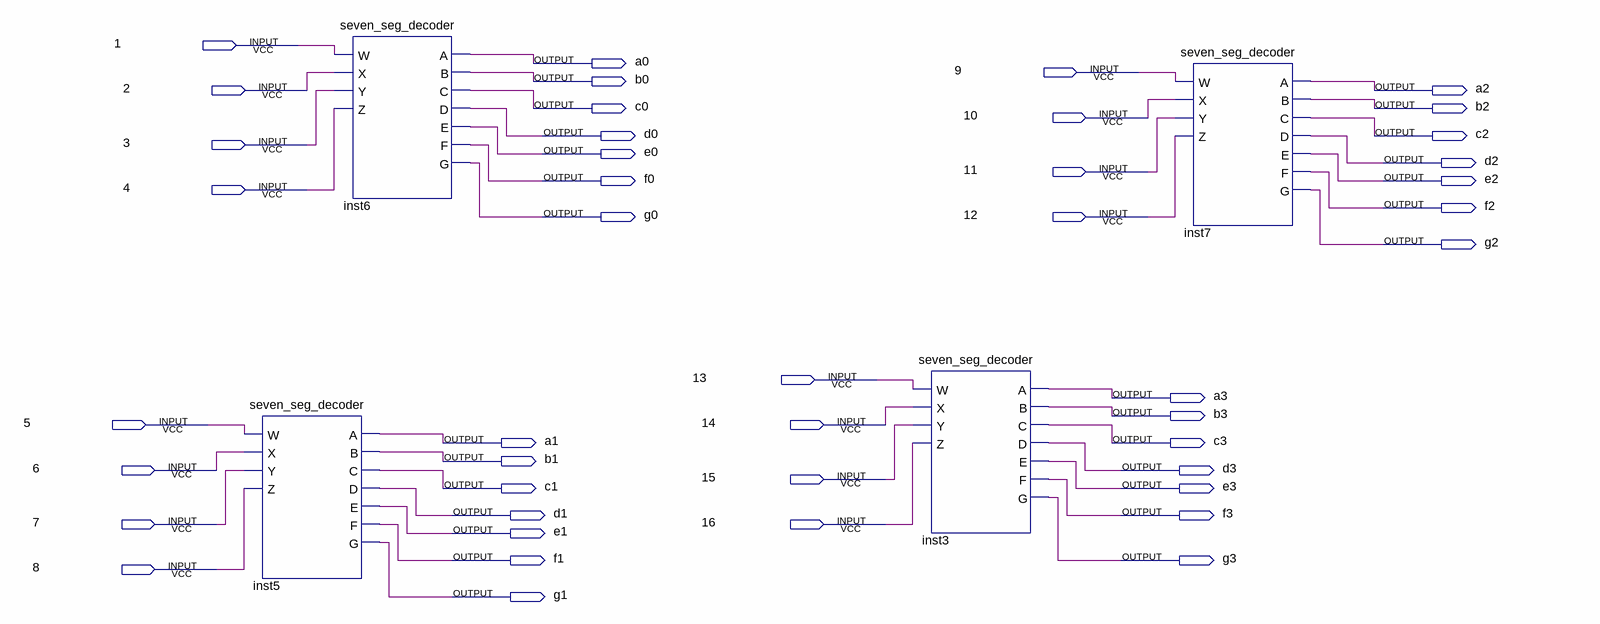
[diagram p0: schematic sheet]
// Quartus schematic lab5step1.bdf as structural Verilog: 4 symbols, 44 pins
module lab5step1 (
  input  \1 ,
  input  \9 ,
  input  \2 ,
  input  \10 ,
  input  \3 ,
  input  \11 ,
  input  \4 ,
  input  \12 ,
  input  \13 ,
  input  \5 ,
  input  \14 ,
  input  \6 ,
  input  \15 ,
  input  \7 ,
  input  \16 ,
  input  \8 ,
  output a0,
  output b0,
  output a2,
  output c0,
  output b2,
  output d0,
  output c2,
  output e0,
  output d2,
  output f0,
  output e2,
  output f2,
  output g0,
  output g2,
  output a3,
  output b3,
  output a1,
  output c3,
  output b1,
  output d3,
  output c1,
  output e3,
  output d1,
  output f3,
  output e1,
  output f1,
  output g3,
  output g1
);

  seven_seg_decoder inst5 (.W(\5 ), .X(\6 ), .Y(\7 ), .Z(\8 ), .A(a1), .B(b1), .C(c1), .D(d1), .E(e1), .F(f1), .G(g1));
  seven_seg_decoder inst6 (.W(\1 ), .X(\2 ), .Y(\3 ), .Z(\4 ), .A(a0), .B(b0), .C(c0), .D(d0), .E(e0), .F(f0), .G(g0));
  seven_seg_decoder inst3 (
    .W(\13 ), .X(\14 ), .Y(\15 ), .Z(\16 ), .A(a3), .B(b3), .C(c3), .D(d3), .E(e3), .F(f3), .G(g3));
  seven_seg_decoder inst7 (
    .W(\9 ), .X(\10 ), .Y(\11 ), .Z(\12 ), .A(a2), .B(b2), .C(c2), .D(d2), .E(e2), .F(f2), .G(g2));
endmodule
